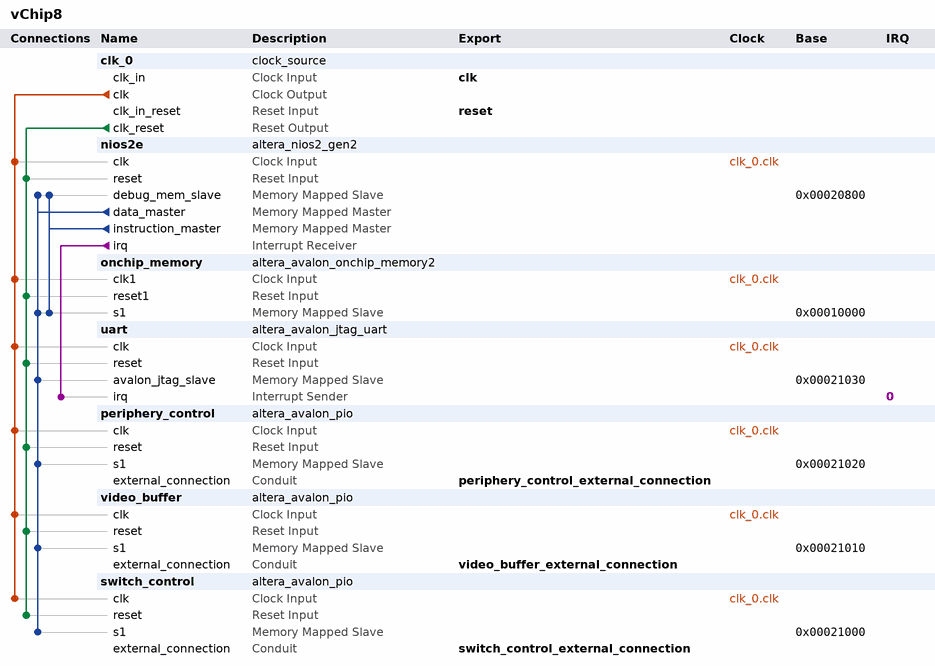
[diagram p0: system contents]
# Platform Designer (Qsys) system vChip8, MAX 10 10M50DAF484C6GES
# Parameters at their usual value, and those the tool derives, are not listed.
package require -exact qsys 17.0
create_system vChip8
set_project_property DEVICE_FAMILY {MAX 10}
set_project_property DEVICE 10M50DAF484C6GES

add_instance clk_0 clock_source 17.0
set_instance_parameter_value clk_0 clockFrequency 50000000

add_instance nios2e altera_nios2_gen2 17.0
set_instance_parameter_value nios2e dcache_size 2048
set_instance_parameter_value nios2e exceptionSlave onchip_memory.s1
set_instance_parameter_value nios2e icache_size 4096
set_instance_parameter_value nios2e impl Tiny
set_instance_parameter_value nios2e resetSlave onchip_memory.s1

add_instance onchip_memory altera_avalon_onchip_memory2 17.0
set_instance_parameter_value onchip_memory dataWidth 32
set_instance_parameter_value onchip_memory dualPort false
set_instance_parameter_value onchip_memory initMemContent false
set_instance_parameter_value onchip_memory initializationFileName onchip_mem.hex
set_instance_parameter_value onchip_memory memorySize 65536

add_instance uart altera_avalon_jtag_uart 17.0
set_instance_parameter_value uart simInteractiveOptions NO_INTERACTIVE_WINDOWS

add_instance periphery_control altera_avalon_pio 17.0
set_instance_parameter_value periphery_control direction Input
set_instance_parameter_value periphery_control width 8

add_instance video_buffer altera_avalon_pio 17.0
set_instance_parameter_value video_buffer direction Output
set_instance_parameter_value video_buffer width 16

add_instance switch_control altera_avalon_pio 17.0
set_instance_parameter_value switch_control direction Input
set_instance_parameter_value switch_control width 16

# connections
add_connection clk_0.clk nios2e.clk clock
add_connection clk_0.clk onchip_memory.clk1 clock
add_connection clk_0.clk periphery_control.clk clock
add_connection clk_0.clk switch_control.clk clock
add_connection clk_0.clk uart.clk clock
add_connection clk_0.clk video_buffer.clk clock
add_connection clk_0.clk_reset nios2e.reset reset
add_connection clk_0.clk_reset onchip_memory.reset1 reset
add_connection clk_0.clk_reset periphery_control.reset reset
add_connection clk_0.clk_reset switch_control.reset reset
add_connection clk_0.clk_reset uart.reset reset
add_connection clk_0.clk_reset video_buffer.reset reset
add_connection nios2e.data_master nios2e.debug_mem_slave avalon
set_connection_parameter_value nios2e.data_master/nios2e.debug_mem_slave baseAddress 0x00020800
add_connection nios2e.data_master onchip_memory.s1 avalon
set_connection_parameter_value nios2e.data_master/onchip_memory.s1 baseAddress 0x00010000
add_connection nios2e.data_master periphery_control.s1 avalon
set_connection_parameter_value nios2e.data_master/periphery_control.s1 baseAddress 0x00021020
add_connection nios2e.data_master switch_control.s1 avalon
set_connection_parameter_value nios2e.data_master/switch_control.s1 baseAddress 0x00021000
add_connection nios2e.data_master uart.avalon_jtag_slave avalon
set_connection_parameter_value nios2e.data_master/uart.avalon_jtag_slave baseAddress 0x00021030
add_connection nios2e.data_master video_buffer.s1 avalon
set_connection_parameter_value nios2e.data_master/video_buffer.s1 baseAddress 0x00021010
add_connection nios2e.instruction_master nios2e.debug_mem_slave avalon
set_connection_parameter_value nios2e.instruction_master/nios2e.debug_mem_slave baseAddress 0x00020800
add_connection nios2e.instruction_master onchip_memory.s1 avalon
set_connection_parameter_value nios2e.instruction_master/onchip_memory.s1 baseAddress 0x00010000
add_connection nios2e.irq uart.irq interrupt
set_connection_parameter_value nios2e.irq/uart.irq irqNumber 0

# exported interfaces
add_interface clk clock sink
set_interface_property clk EXPORT_OF clk_0.clk_in
add_interface periphery_control_external_connection conduit end
set_interface_property periphery_control_external_connection EXPORT_OF periphery_control.external_connection
add_interface reset reset sink
set_interface_property reset EXPORT_OF clk_0.clk_in_reset
add_interface switch_control_external_connection conduit end
set_interface_property switch_control_external_connection EXPORT_OF switch_control.external_connection
add_interface video_buffer_external_connection conduit end
set_interface_property video_buffer_external_connection EXPORT_OF video_buffer.external_connection

set_interconnect_requirement {$system} qsys_mm.clockCrossingAdapter HANDSHAKE
set_interconnect_requirement {$system} qsys_mm.enableEccProtection FALSE
set_interconnect_requirement {$system} qsys_mm.insertDefaultSlave FALSE
set_interconnect_requirement {$system} qsys_mm.maxAdditionalLatency 1

save_system vChip8.qsys
